# EAGLE design stepper_draft1 (EAGLE 9.2.2)

## Sheet 1 of 2
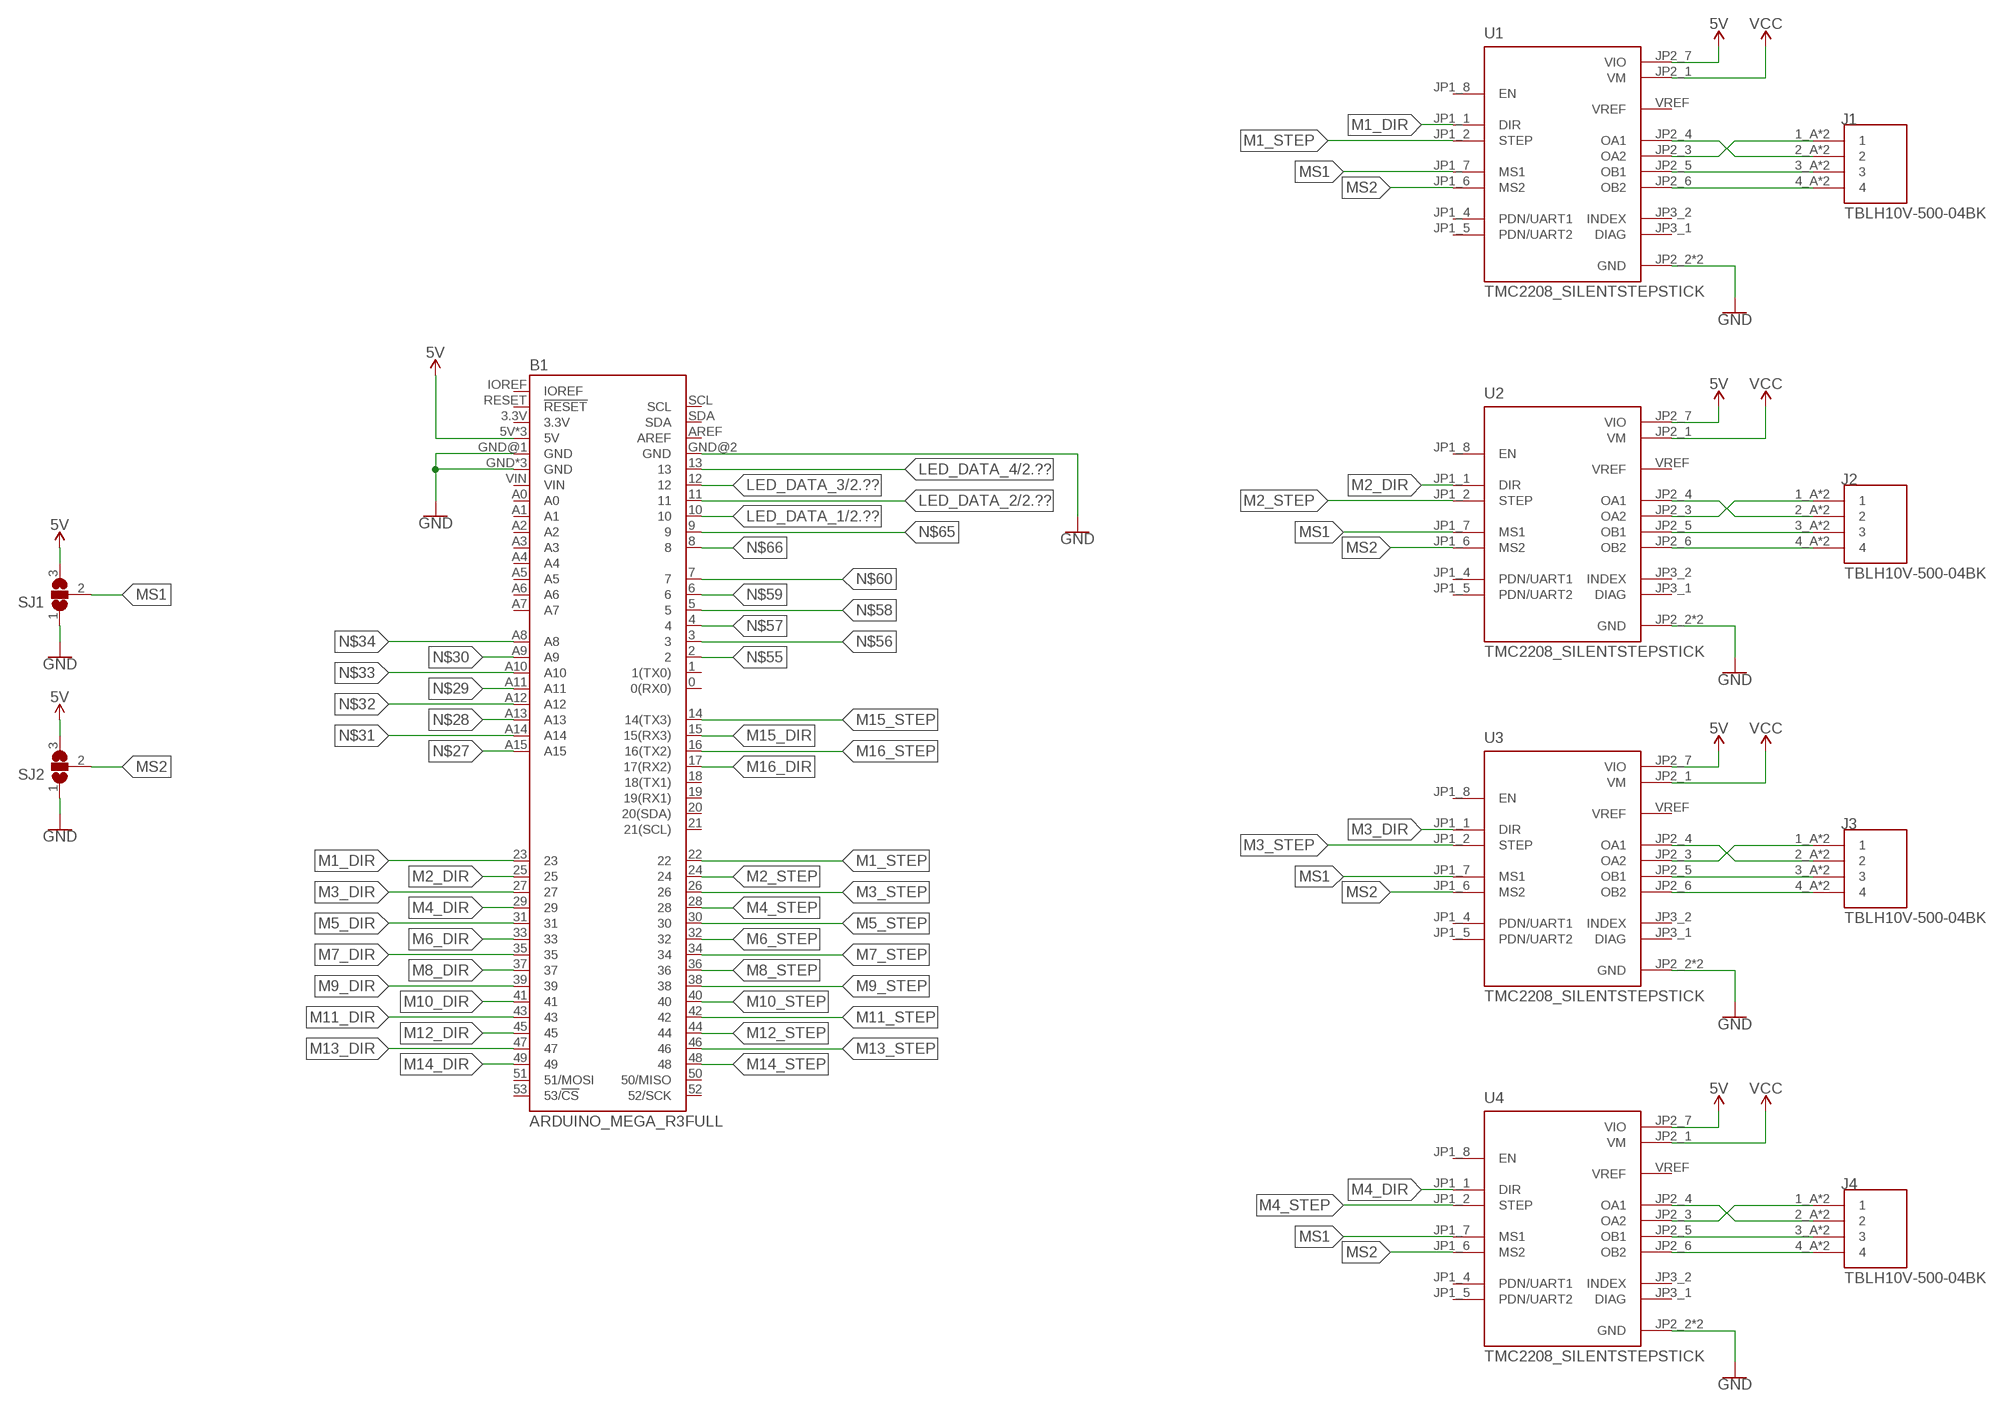
[diagram p0: schematic, sheet 1, part 1 of 2]
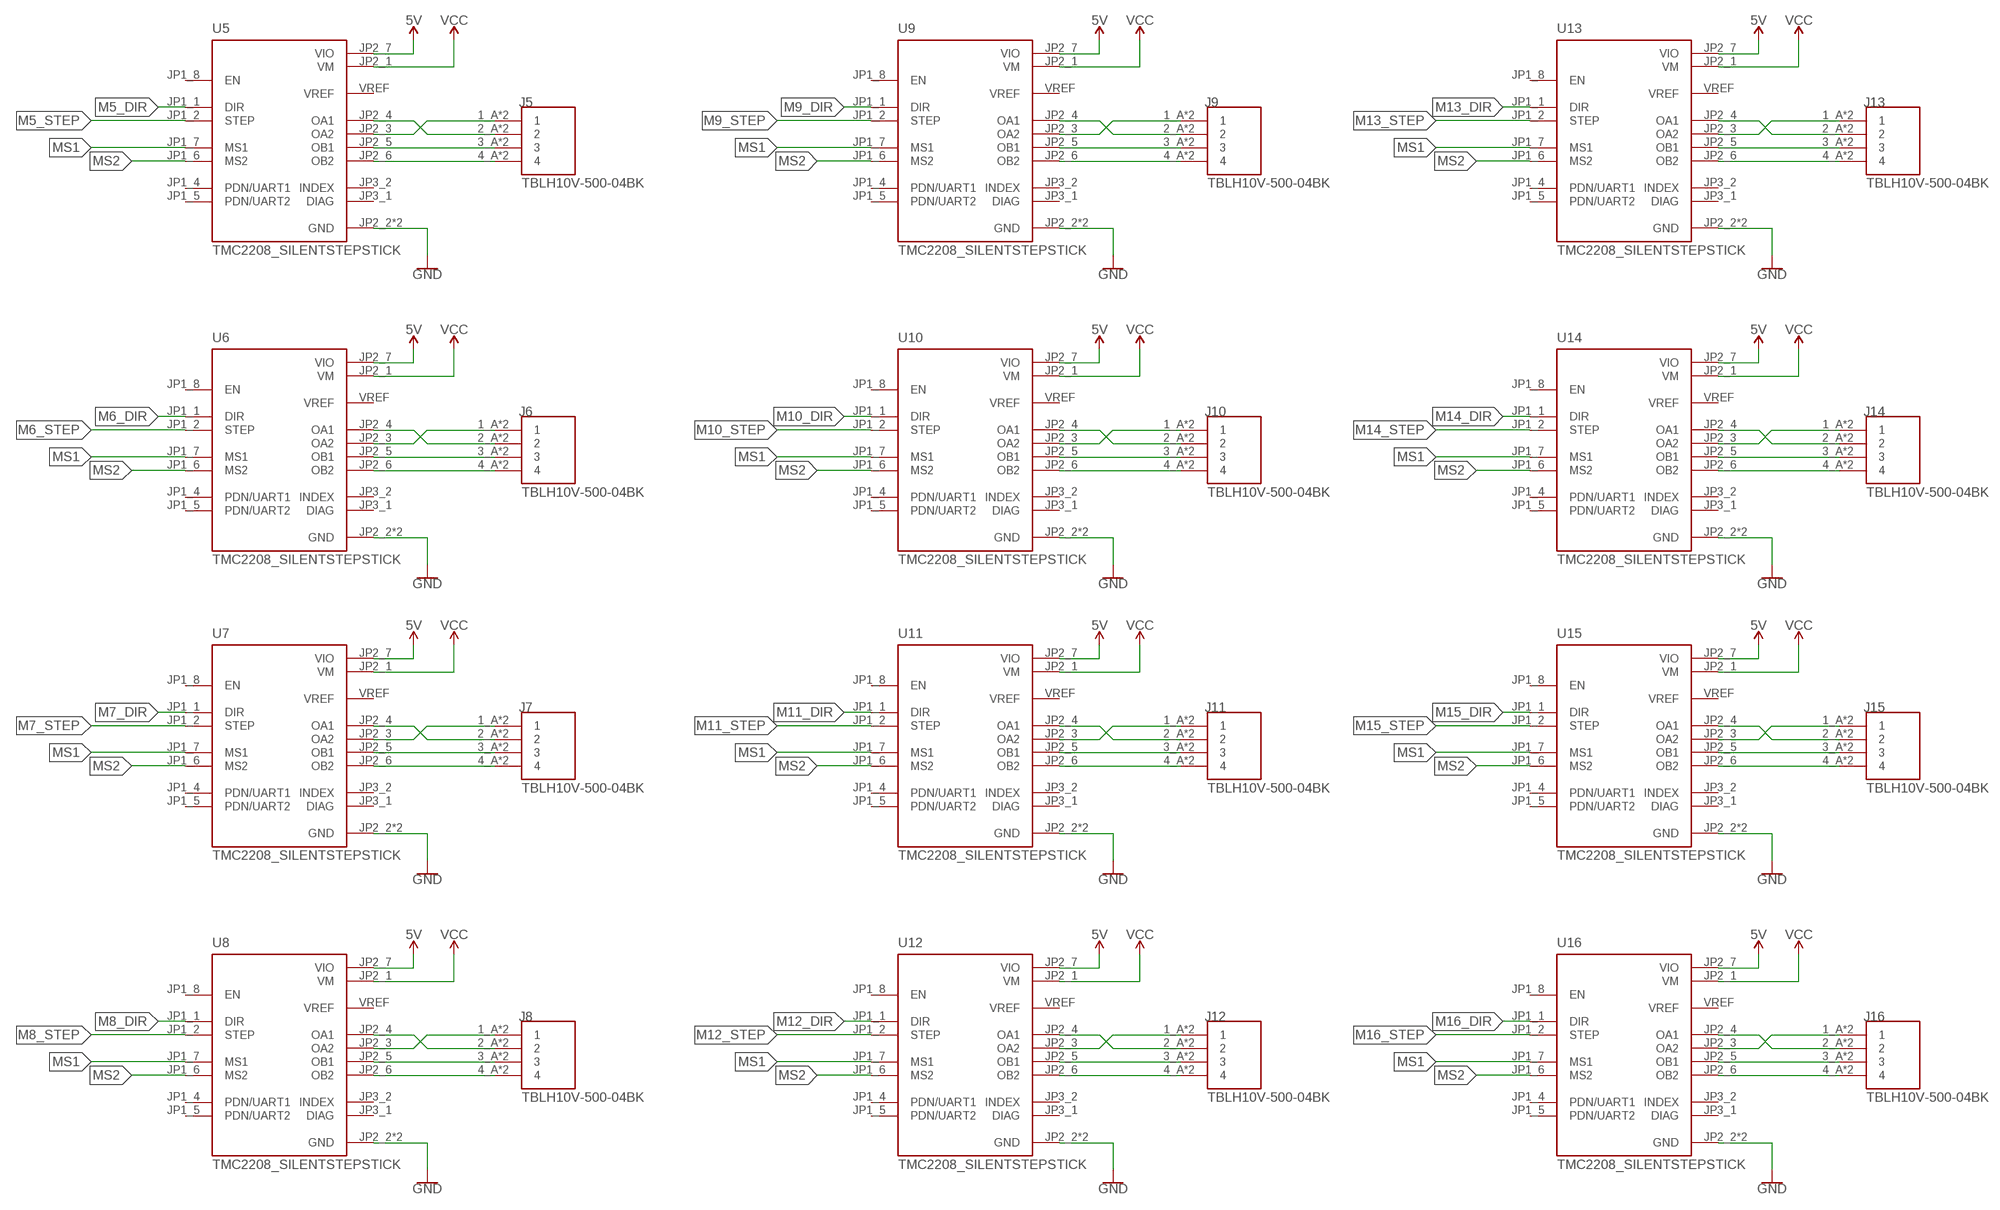
[diagram p1: schematic, sheet 1, part 2 of 2]

### Parts
B1  ARDUINO_MEGA_R3FULL  [ARDUINO_MEGA_NO_SILK]
J1  TBLH10V-500-04BK  [CUI_TBLH10V-500-04BK]
J2  TBLH10V-500-04BK  [CUI_TBLH10V-500-04BK]
J3  TBLH10V-500-04BK  [CUI_TBLH10V-500-04BK]
J4  TBLH10V-500-04BK  [CUI_TBLH10V-500-04BK]
J5  TBLH10V-500-04BK  [CUI_TBLH10V-500-04BK]
J6  TBLH10V-500-04BK  [CUI_TBLH10V-500-04BK]
J7  TBLH10V-500-04BK  [CUI_TBLH10V-500-04BK]
J8  TBLH10V-500-04BK  [CUI_TBLH10V-500-04BK]
J9  TBLH10V-500-04BK  [CUI_TBLH10V-500-04BK]
J10  TBLH10V-500-04BK  [CUI_TBLH10V-500-04BK]
J11  TBLH10V-500-04BK  [CUI_TBLH10V-500-04BK]
J12  TBLH10V-500-04BK  [CUI_TBLH10V-500-04BK]
J13  TBLH10V-500-04BK  [CUI_TBLH10V-500-04BK]
J14  TBLH10V-500-04BK  [CUI_TBLH10V-500-04BK]
J15  TBLH10V-500-04BK  [CUI_TBLH10V-500-04BK]
J16  TBLH10V-500-04BK  [CUI_TBLH10V-500-04BK]
SJ1  SJ2W  [SJ_2]
SJ2  SJ2W  [SJ_2]
U1  TMC2208_SILENTSTEPSTICK  [MODULE_TMC2208_SILENTSTEPSTICK]
U2  TMC2208_SILENTSTEPSTICK  [MODULE_TMC2208_SILENTSTEPSTICK]
U3  TMC2208_SILENTSTEPSTICK  [MODULE_TMC2208_SILENTSTEPSTICK]
U4  TMC2208_SILENTSTEPSTICK  [MODULE_TMC2208_SILENTSTEPSTICK]
U5  TMC2208_SILENTSTEPSTICK  [MODULE_TMC2208_SILENTSTEPSTICK]
U6  TMC2208_SILENTSTEPSTICK  [MODULE_TMC2208_SILENTSTEPSTICK]
U7  TMC2208_SILENTSTEPSTICK  [MODULE_TMC2208_SILENTSTEPSTICK]
U8  TMC2208_SILENTSTEPSTICK  [MODULE_TMC2208_SILENTSTEPSTICK]
U9  TMC2208_SILENTSTEPSTICK  [MODULE_TMC2208_SILENTSTEPSTICK]
U10  TMC2208_SILENTSTEPSTICK  [MODULE_TMC2208_SILENTSTEPSTICK]
U11  TMC2208_SILENTSTEPSTICK  [MODULE_TMC2208_SILENTSTEPSTICK]
U12  TMC2208_SILENTSTEPSTICK  [MODULE_TMC2208_SILENTSTEPSTICK]
U13  TMC2208_SILENTSTEPSTICK  [MODULE_TMC2208_SILENTSTEPSTICK]
U14  TMC2208_SILENTSTEPSTICK  [MODULE_TMC2208_SILENTSTEPSTICK]
U15  TMC2208_SILENTSTEPSTICK  [MODULE_TMC2208_SILENTSTEPSTICK]
U16  TMC2208_SILENTSTEPSTICK  [MODULE_TMC2208_SILENTSTEPSTICK]

### Nets
5V: B1.5V B1.5V@1(5V) B1.5V@2(5V) SJ1.3 SJ2.3 U1.JP2_7(VIO) U2.JP2_7(VIO) U3.JP2_7(VIO) U4.JP2_7(VIO) U5.JP2_7(VIO) U6.JP2_7(VIO) U7.JP2_7(VIO) U8.JP2_7(VIO) U9.JP2_7(VIO) U10.JP2_7(VIO) U11.JP2_7(VIO) U12.JP2_7(VIO) U13.JP2_7(VIO) U14.JP2_7(VIO) U15.JP2_7(VIO) U16.JP2_7(VIO)
GND: B1.GND B1.GND@1(GND) B1.GND@2(GND) B1.GND@3(GND) B1.GND@4(GND) SJ1.1 SJ2.1 U1.JP2_2(GND) U1.JP2_8(GND) U2.JP2_2(GND) U2.JP2_8(GND) U3.JP2_2(GND) U3.JP2_8(GND) U4.JP2_2(GND) U4.JP2_8(GND) U5.JP2_2(GND) U5.JP2_8(GND) U6.JP2_2(GND) U6.JP2_8(GND) U7.JP2_2(GND) U7.JP2_8(GND) U8.JP2_2(GND) U8.JP2_8(GND) U9.JP2_2(GND) U9.JP2_8(GND) U10.JP2_2(GND) U10.JP2_8(GND) U11.JP2_2(GND) U11.JP2_8(GND) U12.JP2_2(GND) U12.JP2_8(GND) U13.JP2_2(GND) U13.JP2_8(GND) U14.JP2_2(GND) U14.JP2_8(GND) U15.JP2_2(GND) U15.JP2_8(GND) U16.JP2_2(GND) U16.JP2_8(GND) ; also sheet 2
LED_DATA_1: B1.10 ; also sheet 2
LED_DATA_2: B1.11 ; also sheet 2
LED_DATA_3: B1.12 ; also sheet 2
LED_DATA_4: B1.13 ; also sheet 2
M1_DIR: B1.23 U1.JP1_1(DIR)
M1_STEP: B1.22 U1.JP1_2(STEP)
M2_DIR: B1.25 U2.JP1_1(DIR)
M2_STEP: B1.24 U2.JP1_2(STEP)
M3_DIR: B1.27 U3.JP1_1(DIR)
M3_STEP: B1.26 U3.JP1_2(STEP)
M4_DIR: B1.29 U4.JP1_1(DIR)
M4_STEP: B1.28 U4.JP1_2(STEP)
M5_DIR: B1.31 U5.JP1_1(DIR)
M5_STEP: B1.30 U5.JP1_2(STEP)
M6_DIR: B1.33 U6.JP1_1(DIR)
M6_STEP: B1.32 U6.JP1_2(STEP)
M7_DIR: B1.35 U7.JP1_1(DIR)
M7_STEP: B1.34 U7.JP1_2(STEP)
M8_DIR: B1.37 U8.JP1_1(DIR)
M8_STEP: B1.36 U8.JP1_2(STEP)
M9_DIR: B1.39 U9.JP1_1(DIR)
M9_STEP: B1.38 U9.JP1_2(STEP)
M10_DIR: B1.41 U10.JP1_1(DIR)
M10_STEP: B1.40 U10.JP1_2(STEP)
M11_DIR: B1.43 U11.JP1_1(DIR)
M11_STEP: B1.42 U11.JP1_2(STEP)
M12_DIR: B1.45 U12.JP1_1(DIR)
M12_STEP: B1.44 U12.JP1_2(STEP)
M13_DIR: B1.47 U13.JP1_1(DIR)
M13_STEP: B1.46 U13.JP1_2(STEP)
M14_DIR: B1.49 U14.JP1_1(DIR)
M14_STEP: B1.48 U14.JP1_2(STEP)
M15_DIR: B1.15(15(RX3)) U15.JP1_1(DIR)
M15_STEP: B1.14(14(TX3)) U15.JP1_2(STEP)
M16_DIR: B1.17(17(RX2)) U16.JP1_1(DIR)
M16_STEP: B1.16(16(TX2)) U16.JP1_2(STEP)
MS1: SJ1.2 U1.JP1_7(MS1) U2.JP1_7(MS1) U3.JP1_7(MS1) U4.JP1_7(MS1) U5.JP1_7(MS1) U6.JP1_7(MS1) U7.JP1_7(MS1) U8.JP1_7(MS1) U9.JP1_7(MS1) U10.JP1_7(MS1) U11.JP1_7(MS1) U12.JP1_7(MS1) U13.JP1_7(MS1) U14.JP1_7(MS1) U15.JP1_7(MS1) U16.JP1_7(MS1)
MS2: SJ2.2 U1.JP1_6(MS2) U2.JP1_6(MS2) U3.JP1_6(MS2) U4.JP1_6(MS2) U5.JP1_6(MS2) U6.JP1_6(MS2) U7.JP1_6(MS2) U8.JP1_6(MS2) U9.JP1_6(MS2) U10.JP1_6(MS2) U11.JP1_6(MS2) U12.JP1_6(MS2) U13.JP1_6(MS2) U14.JP1_6(MS2) U15.JP1_6(MS2) U16.JP1_6(MS2)
N$1: J1.4_A J1.4_B U1.JP2_6(OB2)
N$2: J1.3_A J1.3_B U1.JP2_5(OB1)
N$3: J1.2_A J1.2_B U1.JP2_4(OA1)
N$4: J1.1_A J1.1_B U1.JP2_3(OA2)
N$5: J2.4_A J2.4_B U2.JP2_6(OB2)
N$6: J2.3_A J2.3_B U2.JP2_5(OB1)
N$7: J2.2_A J2.2_B U2.JP2_4(OA1)
N$8: J2.1_A J2.1_B U2.JP2_3(OA2)
N$9: J3.4_A J3.4_B U3.JP2_6(OB2)
N$10: J3.3_A J3.3_B U3.JP2_5(OB1)
N$11: J3.2_A J3.2_B U3.JP2_4(OA1)
N$12: J3.1_A J3.1_B U3.JP2_3(OA2)
N$13: J4.4_A J4.4_B U4.JP2_6(OB2)
N$14: J4.3_A J4.3_B U4.JP2_5(OB1)
N$15: J4.2_A J4.2_B U4.JP2_4(OA1)
N$16: J4.1_A J4.1_B U4.JP2_3(OA2)
N$27: B1.A15
N$28: B1.A13
N$29: B1.A11
N$30: B1.A9
N$31: B1.A14
N$32: B1.A12
N$33: B1.A10
N$34: B1.A8
N$35: J5.4_A J5.4_B U5.JP2_6(OB2)
N$36: J5.3_A J5.3_B U5.JP2_5(OB1)
N$37: J5.2_A J5.2_B U5.JP2_4(OA1)
N$38: J5.1_A J5.1_B U5.JP2_3(OA2)
N$39: J6.4_A J6.4_B U6.JP2_6(OB2)
N$40: J6.3_A J6.3_B U6.JP2_5(OB1)
N$41: J6.2_A J6.2_B U6.JP2_4(OA1)
N$42: J6.1_A J6.1_B U6.JP2_3(OA2)
N$43: J7.4_A J7.4_B U7.JP2_6(OB2)
N$44: J7.3_A J7.3_B U7.JP2_5(OB1)
N$45: J7.2_A J7.2_B U7.JP2_4(OA1)
N$46: J7.1_A J7.1_B U7.JP2_3(OA2)
N$47: J8.4_A J8.4_B U8.JP2_6(OB2)
N$48: J8.3_A J8.3_B U8.JP2_5(OB1)
N$49: J8.2_A J8.2_B U8.JP2_4(OA1)
N$50: J8.1_A J8.1_B U8.JP2_3(OA2)
N$51: J13.4_A J13.4_B U13.JP2_6(OB2)
N$52: J13.3_A J13.3_B U13.JP2_5(OB1)
N$53: J13.2_A J13.2_B U13.JP2_4(OA1)
N$54: J13.1_A J13.1_B U13.JP2_3(OA2)
N$55: B1.2
N$56: B1.3
N$57: B1.4
N$58: B1.5
N$59: B1.6
N$60: B1.7
N$61: J14.4_A J14.4_B U14.JP2_6(OB2)
N$62: J14.3_A J14.3_B U14.JP2_5(OB1)
N$63: J14.2_A J14.2_B U14.JP2_4(OA1)
N$64: J14.1_A J14.1_B U14.JP2_3(OA2)
N$65: B1.9
N$66: B1.8
N$67: J9.4_A J9.4_B U9.JP2_6(OB2)
N$68: J9.3_A J9.3_B U9.JP2_5(OB1)
N$69: J9.2_A J9.2_B U9.JP2_4(OA1)
N$70: J9.1_A J9.1_B U9.JP2_3(OA2)
N$71: J10.4_A J10.4_B U10.JP2_6(OB2)
N$72: J10.3_A J10.3_B U10.JP2_5(OB1)
N$73: J10.2_A J10.2_B U10.JP2_4(OA1)
N$74: J10.1_A J10.1_B U10.JP2_3(OA2)
N$75: J11.4_A J11.4_B U11.JP2_6(OB2)
N$76: J11.3_A J11.3_B U11.JP2_5(OB1)
N$77: J11.2_A J11.2_B U11.JP2_4(OA1)
N$78: J11.1_A J11.1_B U11.JP2_3(OA2)
N$79: J12.4_A J12.4_B U12.JP2_6(OB2)
N$80: J12.3_A J12.3_B U12.JP2_5(OB1)
N$81: J12.2_A J12.2_B U12.JP2_4(OA1)
N$82: J12.1_A J12.1_B U12.JP2_3(OA2)
N$91: J15.4_A J15.4_B U15.JP2_6(OB2)
N$92: J15.3_A J15.3_B U15.JP2_5(OB1)
N$93: J15.2_A J15.2_B U15.JP2_4(OA1)
N$94: J15.1_A J15.1_B U15.JP2_3(OA2)
N$95: J16.4_A J16.4_B U16.JP2_6(OB2)
N$96: J16.3_A J16.3_B U16.JP2_5(OB1)
N$97: J16.2_A J16.2_B U16.JP2_4(OA1)
N$98: J16.1_A J16.1_B U16.JP2_3(OA2)
VCC: U1.JP2_1(VM) U2.JP2_1(VM) U3.JP2_1(VM) U4.JP2_1(VM) U5.JP2_1(VM) U6.JP2_1(VM) U7.JP2_1(VM) U8.JP2_1(VM) U9.JP2_1(VM) U10.JP2_1(VM) U11.JP2_1(VM) U12.JP2_1(VM) U13.JP2_1(VM) U14.JP2_1(VM) U15.JP2_1(VM) U16.JP2_1(VM)
Unconnected: B1.0(0(RX0)) B1.1(1(TX0)) B1.3.3V B1.18(18(TX1)) B1.19(19(RX1)) B1.20(20(SDA)) B1.21(21(SCL)) B1.50(50/MISO) B1.51(51/MOSI) B1.52(52/SCK) B1.53(53/!CS) B1.A0 B1.A1 B1.A2 B1.A3 B1.A4 B1.A5 B1.A6 B1.A7 B1.AREF B1.IOREF B1.RESET(!RESET) B1.SCL B1.SDA B1.VIN U1.JP1_4(PDN/UART1) U1.JP1_5(PDN/UART2) U1.JP1_8(EN) U1.JP3_1(DIAG) U1.JP3_2(INDEX) U1.VREF U2.JP1_4(PDN/UART1) U2.JP1_5(PDN/UART2) U2.JP1_8(EN) U2.JP3_1(DIAG) U2.JP3_2(INDEX) U2.VREF U3.JP1_4(PDN/UART1) U3.JP1_5(PDN/UART2) U3.JP1_8(EN) U3.JP3_1(DIAG) U3.JP3_2(INDEX) U3.VREF U4.JP1_4(PDN/UART1) U4.JP1_5(PDN/UART2) U4.JP1_8(EN) U4.JP3_1(DIAG) U4.JP3_2(INDEX) U4.VREF U5.JP1_4(PDN/UART1) U5.JP1_5(PDN/UART2) U5.JP1_8(EN) U5.JP3_1(DIAG) U5.JP3_2(INDEX) U5.VREF U6.JP1_4(PDN/UART1) U6.JP1_5(PDN/UART2) U6.JP1_8(EN) U6.JP3_1(DIAG) U6.JP3_2(INDEX) U6.VREF U7.JP1_4(PDN/UART1) U7.JP1_5(PDN/UART2) U7.JP1_8(EN) U7.JP3_1(DIAG) U7.JP3_2(INDEX) U7.VREF U8.JP1_4(PDN/UART1) U8.JP1_5(PDN/UART2) U8.JP1_8(EN) U8.JP3_1(DIAG) U8.JP3_2(INDEX) U8.VREF U9.JP1_4(PDN/UART1) U9.JP1_5(PDN/UART2) U9.JP1_8(EN) U9.JP3_1(DIAG) U9.JP3_2(INDEX) U9.VREF U10.JP1_4(PDN/UART1) U10.JP1_5(PDN/UART2) U10.JP1_8(EN) U10.JP3_1(DIAG) U10.JP3_2(INDEX) U10.VREF U11.JP1_4(PDN/UART1) U11.JP1_5(PDN/UART2) U11.JP1_8(EN) U11.JP3_1(DIAG) U11.JP3_2(INDEX) U11.VREF U12.JP1_4(PDN/UART1) U12.JP1_5(PDN/UART2) U12.JP1_8(EN) U12.JP3_1(DIAG) U12.JP3_2(INDEX) U12.VREF U13.JP1_4(PDN/UART1) U13.JP1_5(PDN/UART2) U13.JP1_8(EN) U13.JP3_1(DIAG) U13.JP3_2(INDEX) U13.VREF U14.JP1_4(PDN/UART1) U14.JP1_5(PDN/UART2) U14.JP1_8(EN) U14.JP3_1(DIAG) U14.JP3_2(INDEX) U14.VREF U15.JP1_4(PDN/UART1) U15.JP1_5(PDN/UART2) U15.JP1_8(EN) U15.JP3_1(DIAG) U15.JP3_2(INDEX) U15.VREF U16.JP1_4(PDN/UART1) U16.JP1_5(PDN/UART2) U16.JP1_8(EN) U16.JP3_1(DIAG) U16.JP3_2(INDEX) U16.VREF

## Sheet 2 of 2
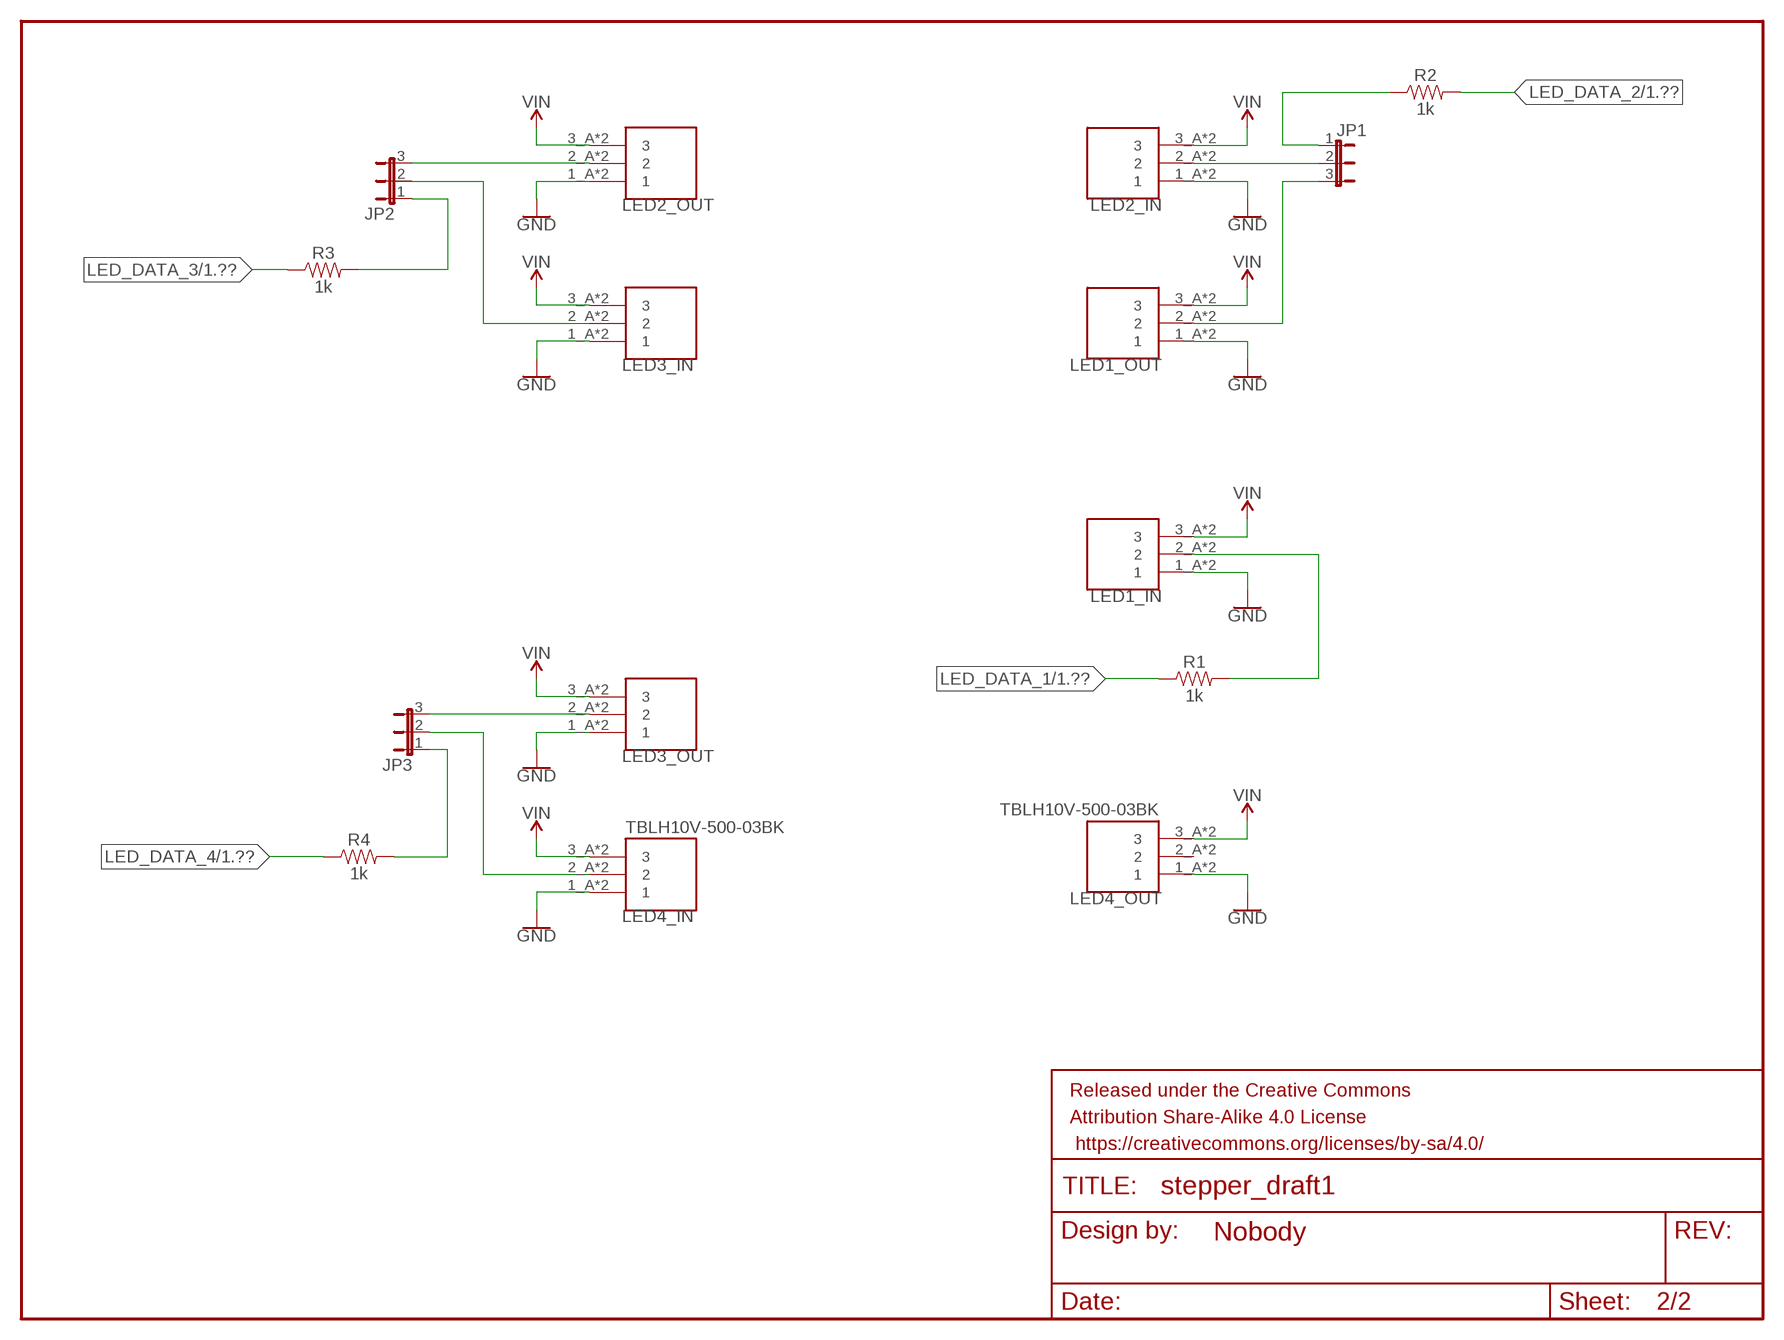
[diagram p2: schematic, sheet 2]

### Parts
FRAME1  FRAME-LETTERNO_PACKAGE  [DUMMY]
JP1  JP2E  [JP2]
JP2  JP2E  [JP2]
JP3  JP2E  [JP2]
LED1_IN  TBLH10V-500-03BK  [CUI_TBLH10V-500-03BK]
LED1_OUT  TBLH10V-500-03BK  [CUI_TBLH10V-500-03BK]
LED2_IN  TBLH10V-500-03BK  [CUI_TBLH10V-500-03BK]
LED2_OUT  TBLH10V-500-03BK  [CUI_TBLH10V-500-03BK]
LED3_IN  TBLH10V-500-03BK  [CUI_TBLH10V-500-03BK]
LED3_OUT  TBLH10V-500-03BK  [CUI_TBLH10V-500-03BK]
LED4_IN  TBLH10V-500-03BK  [CUI_TBLH10V-500-03BK]
LED4_OUT  TBLH10V-500-03BK  [CUI_TBLH10V-500-03BK]
R1  1k  1KOHM-HORIZ-1/4W-5%  [AXIAL-0.3]
R2  1k  1KOHM-HORIZ-1/4W-5%  [AXIAL-0.3]
R3  1k  1KOHM-HORIZ-1/4W-5%  [AXIAL-0.3]
R4  1k  1KOHM-HORIZ-1/4W-5%  [AXIAL-0.3]

### Nets
GND: LED1_IN.1_A LED1_IN.1_B LED1_OUT.1_A LED1_OUT.1_B LED2_IN.1_A LED2_IN.1_B LED2_OUT.1_A LED2_OUT.1_B LED3_IN.1_A LED3_IN.1_B LED3_OUT.1_A LED3_OUT.1_B LED4_IN.1_A LED4_IN.1_B LED4_OUT.1_A LED4_OUT.1_B ; also sheet 1
LED_DATA_1: R1.P$1 ; also sheet 1
LED_DATA_2: R2.P$2 ; also sheet 1
LED_DATA_3: R3.P$1 ; also sheet 1
LED_DATA_4: R4.P$1 ; also sheet 1
N$17: LED1_IN.2_A LED1_IN.2_B R1.P$2
N$18: JP1.3 LED1_OUT.2_A LED1_OUT.2_B
N$19: JP1.1 R2.P$1
N$20: JP1.2 LED2_IN.2_A LED2_IN.2_B
N$21: JP2.3 LED2_OUT.2_A LED2_OUT.2_B
N$22: JP2.1 R3.P$2
N$23: JP2.2 LED3_IN.2_A LED3_IN.2_B
N$24: JP3.1 R4.P$2
N$25: JP3.3 LED3_OUT.2_A LED3_OUT.2_B
N$26: JP3.2 LED4_IN.2_A LED4_IN.2_B
VIN: LED1_IN.3_A LED1_IN.3_B LED1_OUT.3_A LED1_OUT.3_B LED2_IN.3_A LED2_IN.3_B LED2_OUT.3_A LED2_OUT.3_B LED3_IN.3_A LED3_IN.3_B LED3_OUT.3_A LED3_OUT.3_B LED4_IN.3_A LED4_IN.3_B LED4_OUT.3_A LED4_OUT.3_B
Unconnected: LED4_OUT.2_A LED4_OUT.2_B

## Library data of the parts
B1 = SparkFun-Boards:ARDUINO_MEGA_R3: Arduino Mega R3 ATmega2560 R3 compatible footprint. SparkFun Products: Arduino Mega 2560 R3 <https://www.sparkfun.com/products/11061>
FRAME1 = SparkFun-Aesthetics:FRAME-LETTER: Schematic Frame - Letter Standard 8.5x11 US Letter frame; DESIGNER: Nobody; VERSION: v01
J1-J16 = TBLH10V-500-04BK:TBLH10V-500-04BK; CUI_PURCHASE_URL: https://www.cuidevices.com/product/interconnect/connectors/terminal-blocks/tblh10v-500-series?utm_source=snapeda.com&utm_medium=referral&utm_campaign=snapedaBOM; DESCRIPTION: 2~24 Poles, Screwless, Vertical, 5.00 Pitch, 24~16 (AWG), Terminal Block Connector; DIGI-KEY_PART_NUMBER: 102-TBLH10V-500-04BK-ND; MF: CUI Devices; MP: TBLH10V-500-04BK; PACKAGE: None; PURCHASE-URL: https://pricing.snapeda.com/search/part/TBLH10V-500-04BK/?ref=eda
JP1-JP3 = jumper:JP2E: JUMPER
LED1_IN LED1_OUT LED2_IN LED2_OUT LED3_IN LED3_OUT LED4_IN LED4_OUT = TBLH10V-500-03BK:TBLH10V-500-03BK: Check availability <https://pricing.snapeda.com/parts/TBLH10V-500-03BK/CUI%20Devices/view-part?ref=eda>; AVAILABILITY: In Stock; CUI_PURCHASE_URL: https://www.cuidevices.com/product/interconnect/connectors/terminal-blocks/tblh10v-500-series?utm_source=snapeda.com&utm_medium=referral&utm_campaign=snapedaBOM; DESCRIPTION: 2~24 Poles, Screwless, Vertical, 5.00 Pitch, 24~16 (AWG), Terminal Block Connector; MF: CUI Devices; MP: TBLH10V-500-03BK; PACKAGE: None; PRICE: None; PURCHASE-URL: https://pricing.snapeda.com/search/part/TBLH10V-500-03BK/?ref=eda
R1-R4 = SparkFun-Resistors:1KOHM: 1kΩ resistor A resistor is a passive two-terminal electrical component that implements electrical resistance as a circuit element. Resistors act to reduce current flow, and, at the same time, act to lower voltage levels within circuits. - Wikipedia; PROD_ID: RES-08380
SJ1 SJ2 = jumper:SJ2W: SMD solder JUMPER
U1-U16 = TMC2208_SILENTSTEPSTICK:TMC2208_SILENTSTEPSTICK: TMC2208 Motor Controller/Driver, Stepper Power Management Evaluation Board Check availability <https://pricing.snapeda.com/parts/TMC2208%20SILENTSTEPSTICK/Trinamic%20Motion/view-part?ref=eda>; AVAILABILITY: In Stock; DESCRIPTION: TMC2208 Motor Controller/Driver, Stepper Power Management Evaluation Board; MF: Trinamic Motion; MP: TMC2208 SILENTSTEPSTICK; PACKAGE: None; PRICE: None; PURCHASE-URL: https://pricing.snapeda.com/search/part/TMC2208 SILENTSTEPSTICK/?ref=eda

## Board
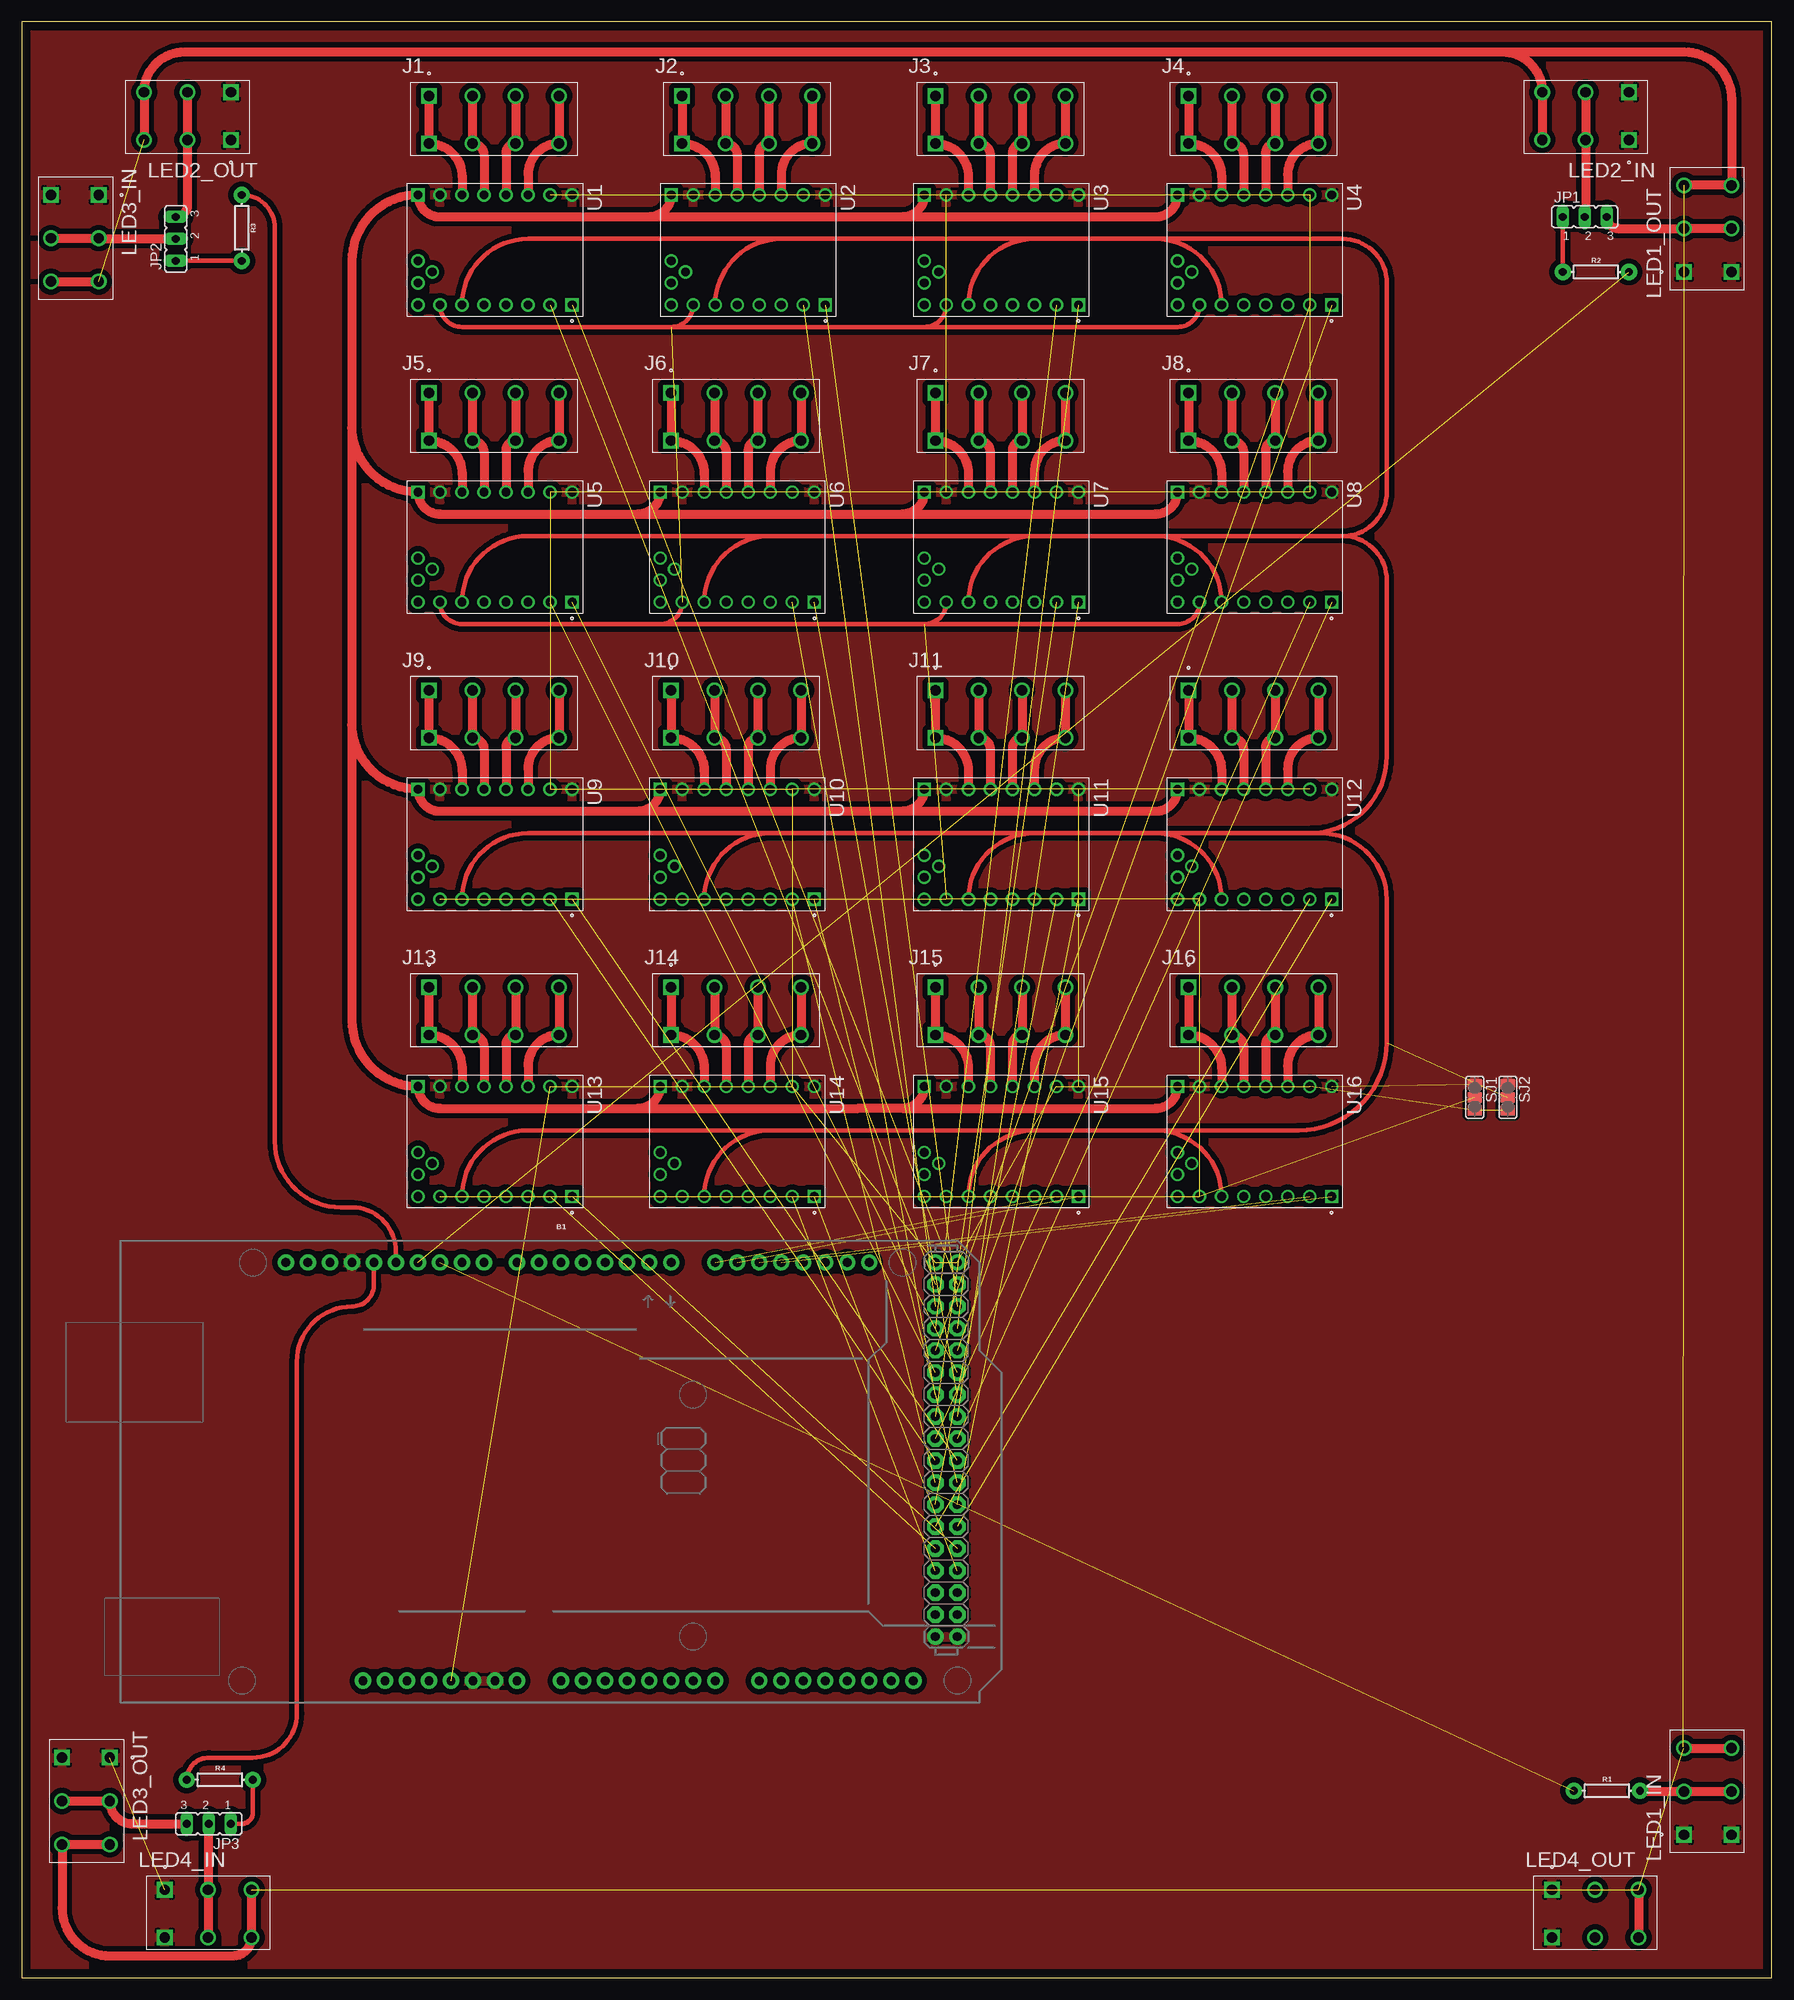
[diagram p3: board, top side]

Size 201.91 x 225.73 mm. Coordinates in mm from the lower left corner, seen from the top.
Outline: 0,0 201.91,0 201.91,225.73 0,225.73 0,0
Copper layers (1*16): Top 0.035mm / dielectric 1.5mm / Bottom 0.035mm
Design rules "default": minimum track width 6mil, minimum drill 0.35mm, track to track 6mil, track to pad 6mil, pad to pad 6mil, via to via 6mil, smd to smd 6mil, copper to edge 40mil, drill to drill 6mil, minimum pad ring 10mil, minimum via ring 8mil, stop-mask expansion 4mil, vias tented up to drill 0mil, thermal gap 10mil

### Footprints (pad centres in the part's own frame; a part is rotated, then mirrored left to right if it is on the bottom)
ARDUINO_MEGA_NO_SILK = drill 1.016 pad 1.88: 0 13.97,24.13; 1 11.43,24.13; 2 8.89,24.13; 3 6.35,24.13; 3.3V -13.97,-24.13; 4 3.81,24.13; 5 1.27,24.13; 5V -11.43,-24.13; 5V@1 44.45,24.13; 5V@2 46.99,24.13; 6 -1.27,24.13; 7 -3.81,24.13; 8 -7.62,24.13; 9 -10.16,24.13; 10 -12.7,24.13; 11 -15.24,24.13; 12 -17.78,24.13; 13 -20.32,24.13; 14 19.05,24.13; 15 21.59,24.13; 16 24.13,24.13; 17 26.67,24.13; 18 29.21,24.13; 19 31.75,24.13; 20 34.29,24.13; 21 36.83,24.13; A0 1.27,-24.13; A1 3.81,-24.13; A2 6.35,-24.13; A3 8.89,-24.13; A4 11.43,-24.13; A5 13.97,-24.13; A6 16.51,-24.13; A7 19.05,-24.13; A8 24.13,-24.13; A9 26.67,-24.13; A10 29.21,-24.13; A11 31.75,-24.13; A12 34.29,-24.13; A13 36.83,-24.13; A14 39.37,-24.13; A15 41.91,-24.13; AREF -25.4,24.13; GND -8.89,-24.13; GND@1 -6.35,-24.13; GND@2 44.45,-19.05; GND@3 46.99,-19.05; GND@4 -22.86,24.13; IOREF -19.05,-24.13; NC -21.59,-24.13; RESET -16.51,-24.13; SCL -30.48,24.13; SDA -27.94,24.13; VIN -3.81,-24.13 | drill 1.016 pad 1.88 octagon: 22 44.45,21.59; 23 46.99,21.59; 24 44.45,19.05; 25 46.99,19.05; 26 44.45,16.51; 27 46.99,16.51; 28 44.45,13.97; 29 46.99,13.97; 30 44.45,11.43; 31 46.99,11.43; 32 44.45,8.89; 33 46.99,8.89; 34 44.45,6.35; 35 46.99,6.35; 36 44.45,3.81; 37 46.99,3.81; 38 44.45,1.27; 39 46.99,1.27; 40 44.45,-1.27; 41 46.99,-1.27; 42 44.45,-3.81; 43 46.99,-3.81; 44 44.45,-6.35; 45 46.99,-6.35; 46 44.45,-8.89; 47 46.99,-8.89; 48 44.45,-11.43; 49 46.99,-11.43; 50 44.45,-13.97; 51 46.99,-13.97; 52 44.45,-16.51; 53 46.99,-16.51
CUI_TBLH10V-500-04BK = drill 1.2 square: 1_A 0,0; 1_B 0,-5.5 | drill 1.2: 2_A 5,0; 2_B 5,-5.5; 3_A 10,0; 3_B 10,-5.5; 4_A 15,0; 4_B 15,-5.5
JP2 = drill 0.914 long: 1 -2.54,0; 2 0,0; 3 2.54,0
CUI_TBLH10V-500-03BK = drill 1.2 square: 1_A 0,0; 1_B 0,-5.5 | drill 1.2: 2_A 5,0; 2_B 5,-5.5; 3_A 10,0; 3_B 10,-5.5
AXIAL-0.3 = drill 0.9 pad 1.88: P$1 -3.81,0; P$2 3.81,0
SJ_2 = smd 1.168 x 1.6: 1 -1.524,0; 2 0,0; 3 1.524,0
MODULE_TMC2208_SILENTSTEPSTICK = drill 1.016 square: JP1_1 6.35,8.89; JP2_1 -6.35,-8.89 | drill 1.016: JP1_2 6.35,6.35; JP1_3 6.35,3.81; JP1_4 6.35,1.27; JP1_5 6.35,-1.27; JP1_6 6.35,-3.81; JP1_7 6.35,-6.35; JP1_8 6.35,-8.89; JP2_2 -6.35,-6.35; JP2_3 -6.35,-3.81; JP2_4 -6.35,-1.27; JP2_5 -6.35,1.27; JP2_6 -6.35,3.81; JP2_7 -6.35,6.35; JP2_8 -6.35,8.89; JP3_1 1.27,-8.89; JP3_2 3.81,-8.89; VREF 2.54,-7.239

### Placement (x,y rotation side)
B1  60.96,58.42 0 top
FRAME1  -3.81,0 0 top  (outside the outline)
J1  46.99,217.17 0 top
J2  76.2,217.17 0 top
J3  105.41,217.17 0 top
J4  134.62,217.17 0 top
J5  46.99,182.88 0 top
J6  74.93,182.88 0 top
J7  105.41,182.88 0 top
J8  134.62,182.88 0 top
J9  46.99,148.59 0 top
J10  74.93,148.59 0 top
J11  105.41,148.59 0 top
J12  134.62,148.59 0 top
J13  46.99,114.3 0 top
J14  74.93,114.3 0 top
J15  105.41,114.3 0 top
J16  134.62,114.3 0 top
JP1  180.34,203.2 0 top
JP2  17.78,200.66 90 top
JP3  21.59,17.78 180 top
LED1_IN  191.77,16.51 90 top
LED1_OUT  191.77,196.85 90 top
LED2_IN  185.42,212.09 180 top
LED2_OUT  24.13,212.09 180 top
LED3_IN  8.89,205.74 270 top
LED3_OUT  10.16,25.4 270 top
LED4_IN  16.51,10.16 0 top
LED4_OUT  176.53,10.16 0 top
R1  182.88,21.59 0 top
R2  181.61,196.85 0 top
R3  25.4,201.93 270 top
R4  22.86,22.86 0 top
SJ1  167.64,101.6 270 top
SJ2  171.45,101.6 270 top
U1  54.61,199.39 270 top
U2  83.82,199.39 270 top
U3  113.03,199.39 270 top
U4  142.24,199.39 270 top
U5  54.61,165.1 270 top
U6  82.55,165.1 270 top
U7  113.03,165.1 270 top
U8  142.24,165.1 270 top
U9  54.61,130.81 270 top
U10  82.55,130.81 270 top
U11  113.03,130.81 270 top
U12  142.24,130.81 270 top
U13  54.61,96.52 270 top
U14  82.55,96.52 270 top
U15  113.03,96.52 270 top
U16  142.24,96.52 270 top

### Tracks (layer width: path | path; a pad name or v marks a point on that pad's centre or on a via)
5V  (20 unrouted)
GND  (4 unrouted)
  pour Top (isolate 0.61): 0,-1.27 203.2,-1.27 203.2,227.33 -1.27,227.33 -1.27,-1.27
LED_DATA_1  (1 unrouted)
LED_DATA_2  (1 unrouted)
LED_DATA_3
  Top 0.508: R3.P$1 arc-90 29.21,201.93 29.21,96.52 arc90 36.83,88.9 38.1,88.9 arc-90 43.18,83.82 B1.12
LED_DATA_4
  Top 0.508: B1.13 40.64,80.01 arc-90 38.1,77.47 arc90 31.75,71.12 31.75,30.48 arc-90 26.67,25.4 21.59,25.4 arc90 R4.P$1
M1_DIR  (1 unrouted)
M1_STEP  (1 unrouted)
M2_DIR  (1 unrouted)
M2_STEP  (1 unrouted)
M3_DIR  (1 unrouted)
M3_STEP  (1 unrouted)
M4_DIR  (1 unrouted)
M4_STEP  (1 unrouted)
M5_DIR  (1 unrouted)
M5_STEP  (1 unrouted)
M6_DIR  (1 unrouted)
M6_STEP  (1 unrouted)
M7_DIR  (1 unrouted)
M7_STEP  (1 unrouted)
M8_DIR  (1 unrouted)
M8_STEP  (1 unrouted)
M9_DIR  (1 unrouted)
M9_STEP  (1 unrouted)
M10_DIR  (1 unrouted)
M10_STEP  (1 unrouted)
M11_DIR  (1 unrouted)
M11_STEP  (1 unrouted)
M12_DIR  (1 unrouted)
M12_STEP  (1 unrouted)
M13_DIR  (1 unrouted)
M13_STEP  (1 unrouted)
M14_DIR  (1 unrouted)
M14_STEP  (1 unrouted)
M15_DIR  (1 unrouted)
M15_STEP  (1 unrouted)
M16_DIR  (1 unrouted)
M16_STEP  (1 unrouted)
MS1  (10 unrouted)
  Top 0.508: U1.JP1_7 arc90 50.8,190.5 74.93,190.5 | 74.93,190.5 104.14,190.5 | 104.14,190.5 133.35,190.5 arc90 U4.JP1_7 | U3.JP1_7 arc-90 104.14,190.5 | U2.JP1_7 arc-90 74.93,190.5 | U5.JP1_7 arc90 50.8,156.21 73.66,156.21 | U8.JP1_7 arc-90 133.35,156.21 104.14,156.21 | 73.66,156.21 104.14,156.21 | U6.JP1_7 arc-90 73.66,156.21 | U7.JP1_7 arc-90 104.14,156.21
MS2  (1 unrouted)
  Top 0.508: U1.JP1_6 arc-90 58.42,200.66 87.63,200.66 | 87.63,200.66 116.84,200.66 | U2.JP1_6 arc-90 87.63,200.66 | U3.JP1_6 arc-90 116.84,200.66 | 116.84,200.66 130.81,200.66 | 130.81,200.66 arc-90 U4.JP1_6 | U5.JP1_6 arc-90 58.42,166.37 86.36,166.37 | 130.81,166.37 arc-90 U8.JP1_6 | 86.36,166.37 116.84,166.37 | 116.84,166.37 130.81,166.37 | U6.JP1_6 arc-90 86.36,166.37 | U7.JP1_6 arc-90 116.84,166.37 | U9.JP1_6 arc-90 58.42,132.08 86.36,132.08 | 130.81,132.08 arc-90 U12.JP1_6 | 86.36,132.08 116.84,132.08 | 116.84,132.08 130.81,132.08 | U13.JP1_6 arc-90 58.42,97.79 86.36,97.79 | 130.81,97.79 arc-90 U16.JP1_6 | 86.36,97.79 116.84,97.79 | 116.84,97.79 130.81,97.79 | U10.JP1_6 arc-90 86.36,132.08 | U11.JP1_6 arc-90 116.84,132.08 | U14.JP1_6 arc-90 86.36,97.79 | U15.JP1_6 arc-90 116.84,97.79 | 130.81,200.66 152.4,200.66 arc-90 157.48,195.58 157.48,171.45 arc-90 152.4,166.37 | 152.4,166.37 130.81,166.37 | 130.81,132.08 148.59,132.08 | 148.59,132.08 arc90 157.48,140.97 157.48,161.29 arc90 152.4,166.37 | 130.81,97.79 147.32,97.79 arc90 157.48,107.95 157.48,124.46 arc90 149.86,132.08 148.59,132.08
N$1
  Top 1.016: J1.4_A J1.4_B arc90 58.42,208.1 U1.JP2_6
N$2
  Top 1.016: J1.3_A J1.3_B arc90 55.88,210.56 U1.JP2_5
N$3
  Top 1.016: J1.2_A J1.2_B arc-90 53.34,210.32 U1.JP2_4
N$4
  Top 1.016: J1.1_A J1.1_B arc-90 50.8,207.86 U1.JP2_3
N$5
  Top 1.016: J2.4_A J2.4_B arc90 87.63,208.1 U2.JP2_6
N$6
  Top 1.016: J2.3_A J2.3_B arc90 85.09,210.56 U2.JP2_5
N$7
  Top 1.016: J2.2_A J2.2_B arc-90 82.55,210.32 U2.JP2_4
N$8
  Top 1.016: J2.1_A J2.1_B arc-90 80.01,207.86 U2.JP2_3
N$9
  Top 1.016: J3.4_A J3.4_B arc90 116.84,208.1 U3.JP2_6
N$10
  Top 1.016: J3.3_A J3.3_B arc90 114.3,210.56 U3.JP2_5
N$11
  Top 1.016: J3.2_A J3.2_B arc-90 111.76,210.32 U3.JP2_4
N$12
  Top 1.016: J3.1_A J3.1_B arc-90 109.22,207.86 U3.JP2_3
N$13
  Top 1.016: J4.4_A J4.4_B arc90 146.05,208.1 U4.JP2_6
N$14
  Top 1.016: J4.3_A J4.3_B arc90 143.51,210.56 U4.JP2_5
N$15
  Top 1.016: J4.2_A J4.2_B arc-90 140.97,210.32 U4.JP2_4
N$16
  Top 1.016: J4.1_A J4.1_B arc-90 138.43,207.86 U4.JP2_3
N$17
  Top 1.016: LED1_IN.2_B LED1_IN.2_A 186.77,21.51 arc-90 R1.P$2
N$18
  Top 1.016: LED1_OUT.2_B LED1_OUT.2_A 184.23,201.85 arc-90 JP1.3
N$19
  Top 0.508: JP1.1 R2.P$1
N$20
  Top 1.016: LED2_IN.2_B LED2_IN.2_A 180.42,203.28 arc-90 JP1.2
N$21
  Top 1.016: LED2_OUT.2_B LED2_OUT.2_A 19.13,204.55 arc-90 JP2.3
N$22
  Top 0.508: JP2.1 R3.P$2
N$23
  Top 1.016: LED3_IN.2_B LED3_IN.2_A arc90 8.97,200.66 JP2.2
N$24
  Top 0.508: R4.P$2 26.67,19.05 arc-90 25.4,17.78 JP3.1
N$25
  Top 1.016: LED3_OUT.2_B LED3_OUT.2_A arc90 12.78,17.78 JP3.3
N$26
  Top 1.016: LED4_IN.2_B LED4_IN.2_A 21.51,17.7 arc-90 JP3.2
N$35
  Top 1.016: J5.4_A J5.4_B arc90 58.42,173.81 U5.JP2_6
N$36
  Top 1.016: J5.3_A J5.3_B arc90 55.88,176.27 U5.JP2_5
N$37
  Top 1.016: J5.2_A J5.2_B arc-90 53.34,176.03 U5.JP2_4
N$38
  Top 1.016: J5.1_A J5.1_B arc-90 50.8,173.57 U5.JP2_3
N$39
  Top 1.016: J6.4_A J6.4_B arc90 86.36,173.81 U6.JP2_6
N$40
  Top 1.016: J6.3_A J6.3_B arc90 83.82,176.27 U6.JP2_5
N$41
  Top 1.016: J6.2_A J6.2_B arc-90 81.28,176.03 U6.JP2_4
N$42
  Top 1.016: J6.1_A J6.1_B arc-90 78.74,173.57 U6.JP2_3
N$43
  Top 1.016: J7.4_A J7.4_B arc90 116.84,173.81 U7.JP2_6
N$44
  Top 1.016: J7.3_A J7.3_B arc90 114.3,176.27 U7.JP2_5
N$45
  Top 1.016: J7.2_A J7.2_B arc-90 111.76,176.03 U7.JP2_4
N$46
  Top 1.016: J7.1_A J7.1_B arc-90 109.22,173.57 U7.JP2_3
N$47
  Top 1.016: J8.4_A J8.4_B arc90 146.05,173.81 U8.JP2_6
N$48
  Top 1.016: J8.3_A J8.3_B arc90 143.51,176.27 U8.JP2_5
N$49
  Top 1.016: J8.2_A J8.2_B arc-90 140.97,176.03 U8.JP2_4
N$50
  Top 1.016: J8.1_A J8.1_B arc-90 138.43,173.57 U8.JP2_3
N$51
  Top 1.016: J13.4_A J13.4_B arc90 58.42,105.23 U13.JP2_6
N$52
  Top 1.016: J13.3_A J13.3_B arc90 55.88,107.69 U13.JP2_5
N$53
  Top 1.016: J13.2_A J13.2_B arc-90 53.34,107.45 U13.JP2_4
N$54
  Top 1.016: J13.1_A J13.1_B arc-90 50.8,104.99 U13.JP2_3
N$61
  Top 1.016: J14.4_A J14.4_B arc90 86.36,105.23 U14.JP2_6
N$62
  Top 1.016: J14.3_A J14.3_B arc90 83.82,107.69 U14.JP2_5
N$63
  Top 1.016: J14.2_A J14.2_B arc-90 81.28,107.45 U14.JP2_4
N$64
  Top 1.016: J14.1_A J14.1_B arc-90 78.74,104.99 U14.JP2_3
N$67
  Top 1.016: J9.4_A J9.4_B arc90 58.42,139.52 U9.JP2_6
N$68
  Top 1.016: J9.3_A J9.3_B arc90 55.88,141.98 U9.JP2_5
N$69
  Top 1.016: J9.2_A J9.2_B arc-90 53.34,141.74 U9.JP2_4
N$70
  Top 1.016: J9.1_A J9.1_B arc-90 50.8,139.28 U9.JP2_3
N$71
  Top 1.016: J10.4_A J10.4_B arc90 86.36,139.52 U10.JP2_6
N$72
  Top 1.016: J10.3_A J10.3_B arc90 83.82,141.98 U10.JP2_5
N$73
  Top 1.016: J10.2_A J10.2_B arc-90 81.28,141.74 U10.JP2_4
N$74
  Top 1.016: J10.1_A J10.1_B arc-90 78.74,139.28 U10.JP2_3
N$75
  Top 1.016: J11.4_A J11.4_B arc90 116.84,139.52 U11.JP2_6
N$76
  Top 1.016: J11.3_A J11.3_B arc90 114.3,141.98 U11.JP2_5
N$77
  Top 1.016: J11.2_A J11.2_B arc-90 111.76,141.74 U11.JP2_4
N$78
  Top 1.016: J11.1_A J11.1_B arc-90 109.22,139.28 U11.JP2_3
N$79
  Top 1.016: J12.4_A J12.4_B arc90 146.05,139.52 U12.JP2_6
N$80
  Top 1.016: J12.3_A J12.3_B arc90 143.51,141.98 U12.JP2_5
N$81
  Top 1.016: J12.2_A J12.2_B arc-90 140.97,141.74 U12.JP2_4
N$82
  Top 1.016: J12.1_A J12.1_B arc-90 138.43,139.28 U12.JP2_3
N$91
  Top 1.016: J15.4_A J15.4_B arc90 116.84,105.23 U15.JP2_6
N$92
  Top 1.016: J15.3_A J15.3_B arc90 114.3,107.69 U15.JP2_5
N$93
  Top 1.016: J15.2_A J15.2_B arc-90 111.76,107.45 U15.JP2_4
N$94
  Top 1.016: J15.1_A J15.1_B arc-90 109.22,104.99 U15.JP2_3
N$95
  Top 1.016: J16.4_A J16.4_B arc90 146.05,105.23 U16.JP2_6
N$96
  Top 1.016: J16.3_A J16.3_B arc90 143.51,107.69 U16.JP2_5
N$97
  Top 1.016: J16.2_A J16.2_B arc-90 140.97,107.45 U16.JP2_4
N$98
  Top 1.016: J16.1_A J16.1_B arc-90 138.43,104.99 U16.JP2_3
VCC
  Top 1.016: 72.39,203.2 48.26,203.2 arc-90 U1.JP2_1 arc90 38.1,198.12 38.1,179.07 | 72.39,203.2 101.6,203.2 | 101.6,203.2 130.81,203.2 arc90 U4.JP2_1 | U2.JP2_1 arc-90 72.39,203.2 | U3.JP2_1 arc-90 101.6,203.2 | 71.12,168.91 48.26,168.91 arc-90 U5.JP2_1 arc-90 38.1,179.07 | 71.12,168.91 101.6,168.91 | 101.6,168.91 130.81,168.91 arc90 U8.JP2_1 | U7.JP2_1 arc-90 101.6,168.91 | U6.JP2_1 arc-90 71.12,168.91 | 38.1,179.07 38.1,144.78 | 38.1,144.78 38.1,110.49 arc90 U13.JP2_1 arc90 48.26,100.33 71.12,100.33 | 38.1,144.78 arc90 U9.JP2_1 arc90 48.26,134.62 71.12,134.62 | U12.JP2_1 arc-90 130.81,134.62 101.6,134.62 | 71.12,134.62 101.6,134.62 | U16.JP2_1 arc-90 130.81,100.33 101.6,100.33 | 71.12,100.33 96.52,100.33 101.6,100.33 | U10.JP2_1 arc-90 71.12,134.62 | U11.JP2_1 arc-90 101.6,134.62 | U14.JP2_1 arc-90 71.12,100.33 | U15.JP2_1 arc-90 101.6,100.33
VIN  (4 unrouted)
  Top 1.016: LED2_OUT.3_A LED2_OUT.3_B arc-90 18.79,222.25 170.76,222.25 | LED3_IN.3_B LED3_IN.3_A | LED2_IN.3_A LED2_IN.3_B arc90 170.76,222.25 | LED1_OUT.3_A LED1_OUT.3_B 197.27,216.75 arc90 191.77,222.25 170.76,222.25 | LED3_OUT.3_A LED3_OUT.3_B 4.66,8.04 arc90 10.16,2.54 24.39,2.54 arc90 LED4_IN.3_B LED4_IN.3_A | LED4_OUT.3_A LED4_OUT.3_B | LED1_IN.3_B LED1_IN.3_A arc90 191.61,26.67